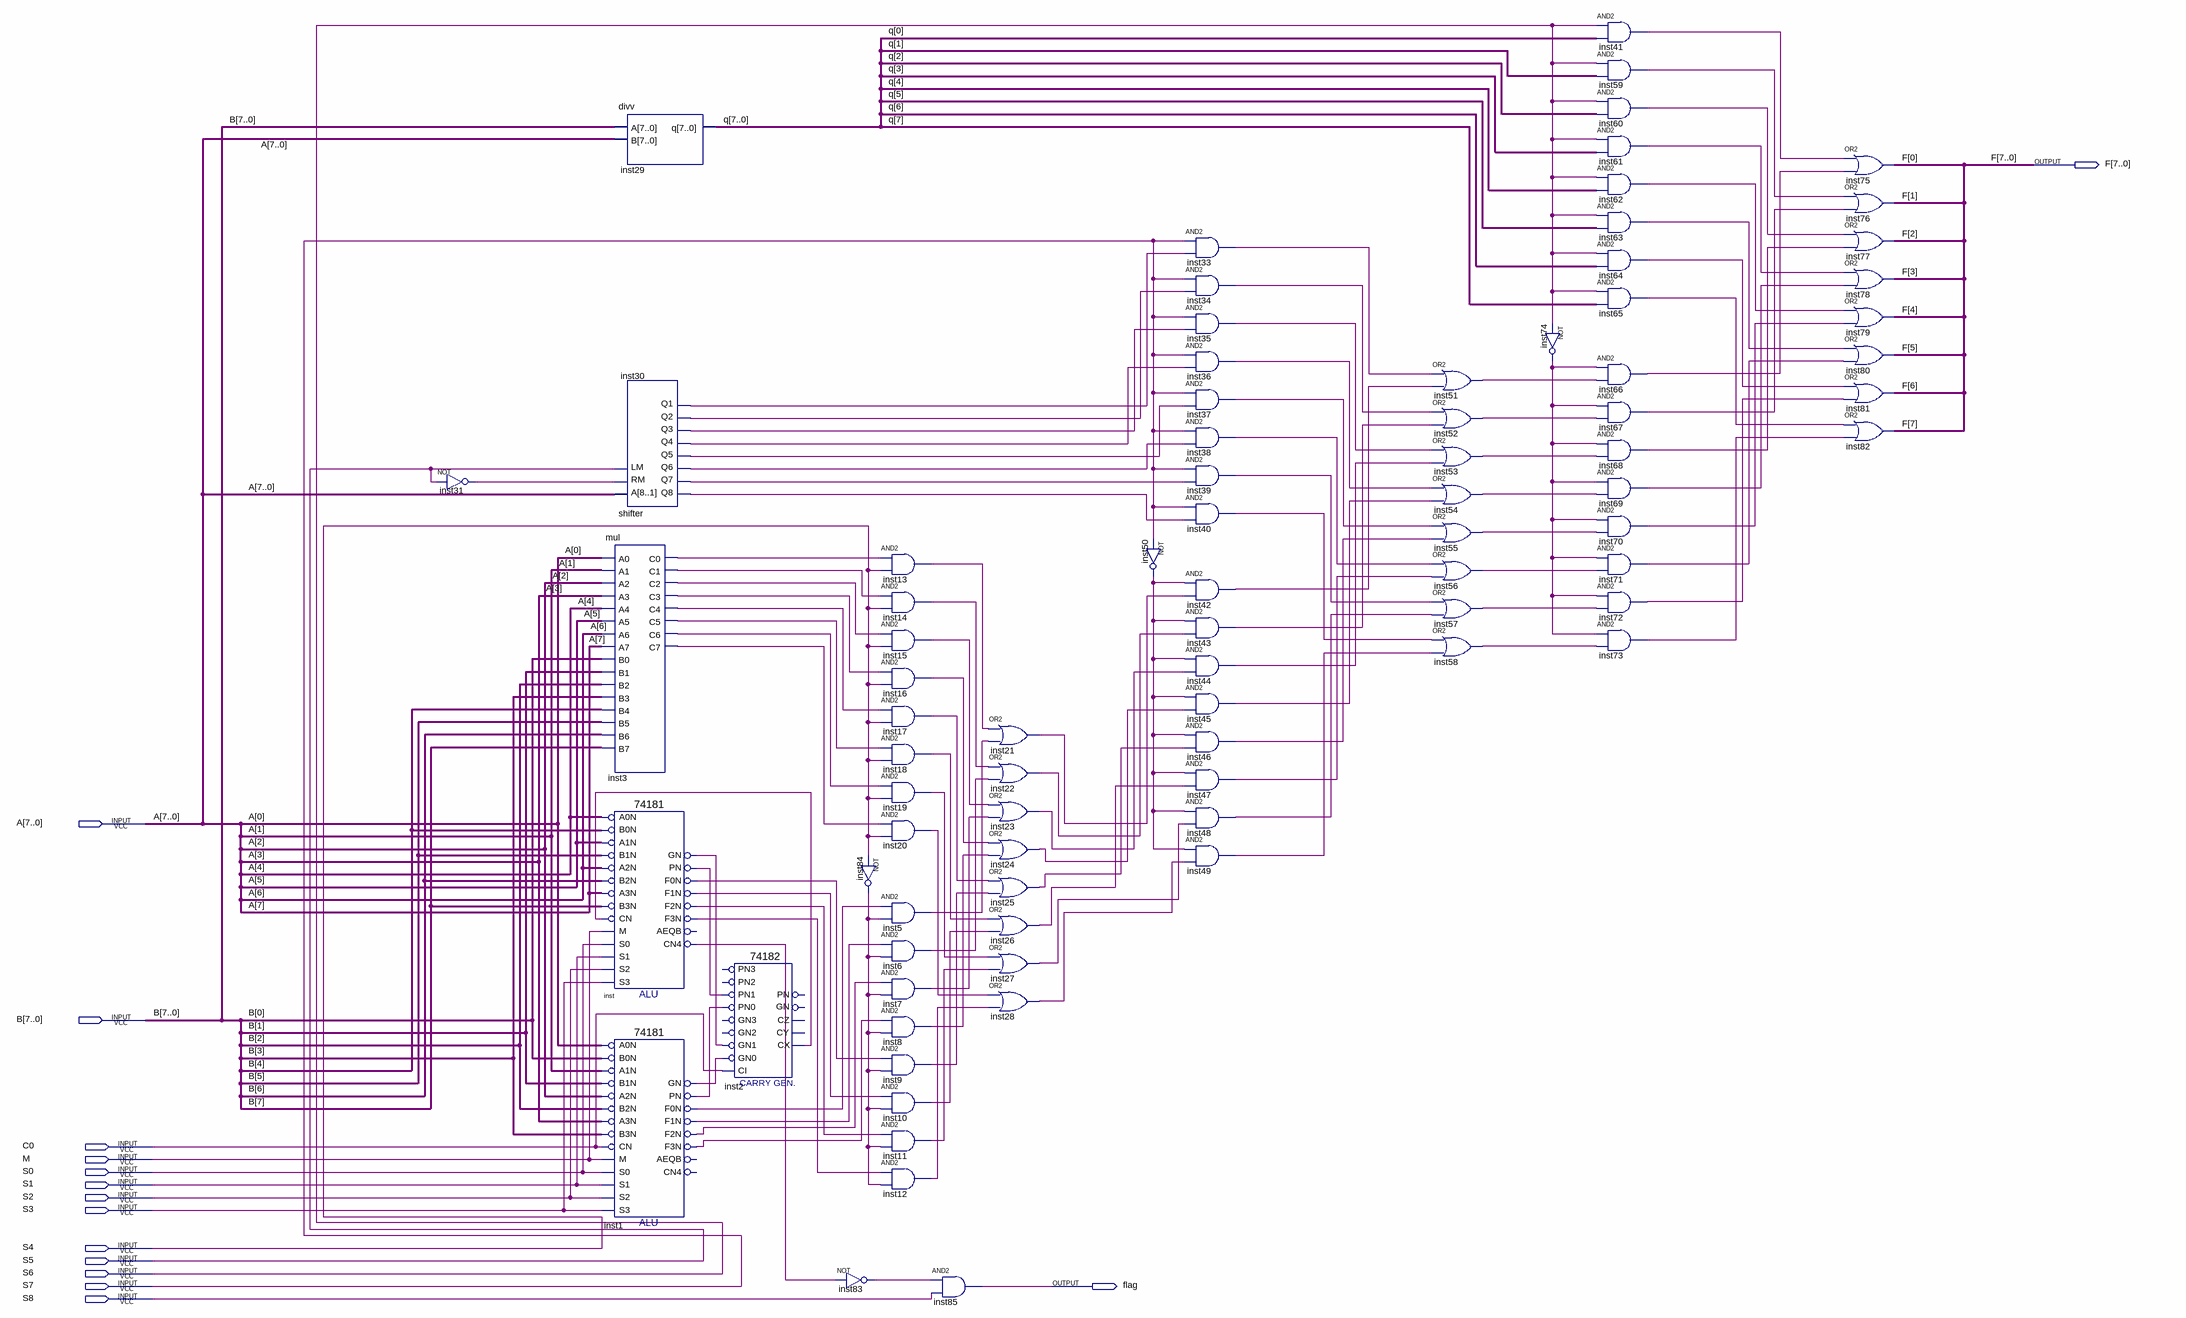
[diagram p0: schematic sheet]
// Quartus schematic ALU.bdf as structural Verilog: 84 symbols, 15 pins
module ALU (
  input  [7:0] A,
  input  [7:0] B,
  input  C0,
  input  M,
  input  S0,
  input  S1,
  input  S2,
  input  S3,
  input  S4,
  input  S5,
  input  S6,
  input  S7,
  input  S8,
  output [7:0] F,
  output flag
);

  wire inst1_f0n, inst1_f1n, inst1_f2n, inst1_f3n, inst1_gn, inst1_pn, inst2_cx, inst3_c0, inst3_c1,
       inst3_c2, inst3_c3, inst3_c4, inst3_c5, inst3_c6, inst3_c7, inst5_out, inst6_out, inst7_out,
       inst8_out, inst9_out, inst10_out, inst11_out, inst12_out, inst13_out, inst14_out, inst15_out,
       inst16_out, inst17_out, inst18_out, inst19_out, inst20_out, inst21_out, inst22_out, inst23_out,
       inst24_out, inst25_out, inst26_out, inst27_out, inst28_out, inst30_q1, inst30_q2, inst30_q3,
       inst30_q4, inst30_q5, inst30_q6, inst30_q7, inst30_q8, inst31_out, inst33_out, inst34_out, inst35_out,
       inst36_out, inst37_out, inst38_out, inst39_out, inst40_out, inst41_out, inst42_out, inst43_out,
       inst44_out, inst45_out, inst46_out, inst47_out, inst48_out, inst49_out, inst50_out, inst51_out,
       inst52_out, inst53_out, inst54_out, inst55_out, inst56_out, inst57_out, inst58_out, inst59_out,
       inst60_out, inst61_out, inst62_out, inst63_out, inst64_out, inst65_out, inst66_out, inst67_out,
       inst68_out, inst69_out, inst70_out, inst71_out, inst72_out, inst73_out, inst74_out, inst83_out,
       inst84_out, inst_cn4, inst_f0n, inst_f1n, inst_f2n, inst_f3n, inst_gn, inst_pn;
  wire [7:0] q;

  not inst31 (inst31_out, S5);
  mul inst3 (
    .A0(A[0]), .A1(A[1]), .A2(A[2]), .A3(A[3]), .A4(A[4]), .A5(A[5]), .A6(A[6]), .A7(A[7]), .B0(B[0]),
    .B1(B[1]), .B2(B[2]), .B3(B[3]), .B4(B[4]), .B5(B[5]), .B6(B[6]), .B7(B[7]), .C0(inst3_c0),
    .C1(inst3_c1), .C2(inst3_c2), .C3(inst3_c3), .C4(inst3_c4), .C5(inst3_c5), .C6(inst3_c6), .C7(inst3_c7));
  \74181  inst (
    .B0N(B[4]), .A0N(A[4]), .A1N(A[5]), .B1N(B[5]), .A3N(A[7]), .B2N(B[6]), .A2N(A[6]), .M(M), .CN(inst2_cx),
    .B3N(B[7]), .S2(S2), .S1(S1), .S0(S0), .S3(S3), .PN(inst_pn), .GN(inst_gn), .F3N(inst_f3n),
    .F1N(inst_f1n), .F0N(inst_f0n), .CN4(inst_cn4), .F2N(inst_f2n));  // open: AEQB
  \74181  inst1 (
    .B0N(B[0]), .A0N(A[0]), .A1N(A[1]), .B1N(B[1]), .A3N(A[3]), .B2N(B[2]), .A2N(A[2]), .M(M), .CN(C0),
    .B3N(B[3]), .S2(S2), .S1(S1), .S0(S0), .S3(S3), .PN(inst1_pn), .GN(inst1_gn), .F3N(inst1_f3n),
    .F1N(inst1_f1n), .F0N(inst1_f0n), .F2N(inst1_f2n));  // open: AEQB, CN4
  divv inst29 (.A(B), .B(A), .q(q));
  shifter inst30 (
    .A(A), .RM(inst31_out), .LM(S5), .Q8(inst30_q8), .Q7(inst30_q7), .Q6(inst30_q6), .Q5(inst30_q5),
    .Q4(inst30_q4), .Q3(inst30_q3), .Q2(inst30_q2), .Q1(inst30_q1));
  \74182  inst2 (
    .CI(C0), .PN1(inst_pn), .PN0(inst1_pn), .GN1(inst_gn), .GN0(inst1_gn), .CX(inst2_cx));  // open: PN2, GN2, GN3, PN3, CY, PN, CZ, GN
  not inst84 (inst84_out, S4);
  not inst83 (inst83_out, inst_cn4);
  and inst13 (inst13_out, inst3_c0, S4);
  and inst14 (inst14_out, inst3_c1, S4);
  and inst15 (inst15_out, inst3_c2, S4);
  and inst16 (inst16_out, inst3_c3, S4);
  and inst17 (inst17_out, inst3_c4, S4);
  and inst18 (inst18_out, inst3_c5, S4);
  and inst19 (inst19_out, inst3_c6, S4);
  and inst20 (inst20_out, inst3_c7, S4);
  and inst5 (inst5_out, inst1_f0n, inst84_out);
  and inst6 (inst6_out, inst1_f1n, inst84_out);
  and inst7 (inst7_out, inst1_f2n, inst84_out);
  and inst8 (inst8_out, inst1_f3n, inst84_out);
  and inst9 (inst9_out, inst_f0n, inst84_out);
  and inst10 (inst10_out, inst_f1n, inst84_out);
  and inst11 (inst11_out, inst_f2n, inst84_out);
  and inst12 (inst12_out, inst_f3n, inst84_out);
  and inst85 (flag, inst83_out, S8);
  or inst21 (inst21_out, inst13_out, inst5_out);
  or inst22 (inst22_out, inst14_out, inst6_out);
  or inst23 (inst23_out, inst15_out, inst7_out);
  or inst24 (inst24_out, inst16_out, inst8_out);
  or inst25 (inst25_out, inst17_out, inst9_out);
  or inst26 (inst26_out, inst18_out, inst10_out);
  or inst27 (inst27_out, inst19_out, inst11_out);
  or inst28 (inst28_out, inst20_out, inst12_out);
  not inst50 (inst50_out, S7);
  and inst33 (inst33_out, S7, inst30_q1);
  and inst34 (inst34_out, S7, inst30_q2);
  and inst35 (inst35_out, S7, inst30_q3);
  and inst36 (inst36_out, S7, inst30_q4);
  and inst37 (inst37_out, S7, inst30_q5);
  and inst38 (inst38_out, S7, inst30_q6);
  and inst39 (inst39_out, S7, inst30_q7);
  and inst40 (inst40_out, S7, inst30_q8);
  and inst42 (inst42_out, inst50_out, inst21_out);
  and inst43 (inst43_out, inst50_out, inst22_out);
  and inst44 (inst44_out, inst50_out, inst23_out);
  and inst45 (inst45_out, inst50_out, inst24_out);
  and inst46 (inst46_out, inst50_out, inst25_out);
  and inst47 (inst47_out, inst50_out, inst26_out);
  and inst48 (inst48_out, inst50_out, inst27_out);
  and inst49 (inst49_out, inst50_out, inst28_out);
  or inst51 (inst51_out, inst33_out, inst42_out);
  or inst52 (inst52_out, inst34_out, inst43_out);
  or inst53 (inst53_out, inst35_out, inst44_out);
  or inst54 (inst54_out, inst36_out, inst45_out);
  or inst55 (inst55_out, inst37_out, inst46_out);
  or inst56 (inst56_out, inst38_out, inst47_out);
  or inst57 (inst57_out, inst39_out, inst48_out);
  or inst58 (inst58_out, inst40_out, inst49_out);
  not inst74 (inst74_out, S6);
  and inst41 (inst41_out, S6, q[0]);
  and inst59 (inst59_out, S6, q[1]);
  and inst60 (inst60_out, S6, q[2]);
  and inst61 (inst61_out, S6, q[3]);
  and inst62 (inst62_out, S6, q[4]);
  and inst63 (inst63_out, S6, q[5]);
  and inst64 (inst64_out, S6, q[6]);
  and inst65 (inst65_out, S6, q[7]);
  and inst66 (inst66_out, inst74_out, inst51_out);
  and inst67 (inst67_out, inst74_out, inst52_out);
  and inst68 (inst68_out, inst74_out, inst53_out);
  and inst69 (inst69_out, inst74_out, inst54_out);
  and inst70 (inst70_out, inst74_out, inst55_out);
  and inst71 (inst71_out, inst74_out, inst56_out);
  and inst72 (inst72_out, inst74_out, inst57_out);
  and inst73 (inst73_out, inst74_out, inst58_out);
  or inst75 (F[0], inst41_out, inst66_out);
  or inst76 (F[1], inst59_out, inst67_out);
  or inst77 (F[2], inst60_out, inst68_out);
  or inst78 (F[3], inst61_out, inst69_out);
  or inst79 (F[4], inst62_out, inst70_out);
  or inst80 (F[5], inst63_out, inst71_out);
  or inst81 (F[6], inst64_out, inst72_out);
  or inst82 (F[7], inst65_out, inst73_out);
endmodule
